# EAGLE design Ikaruga (EAGLE 7.7.0)
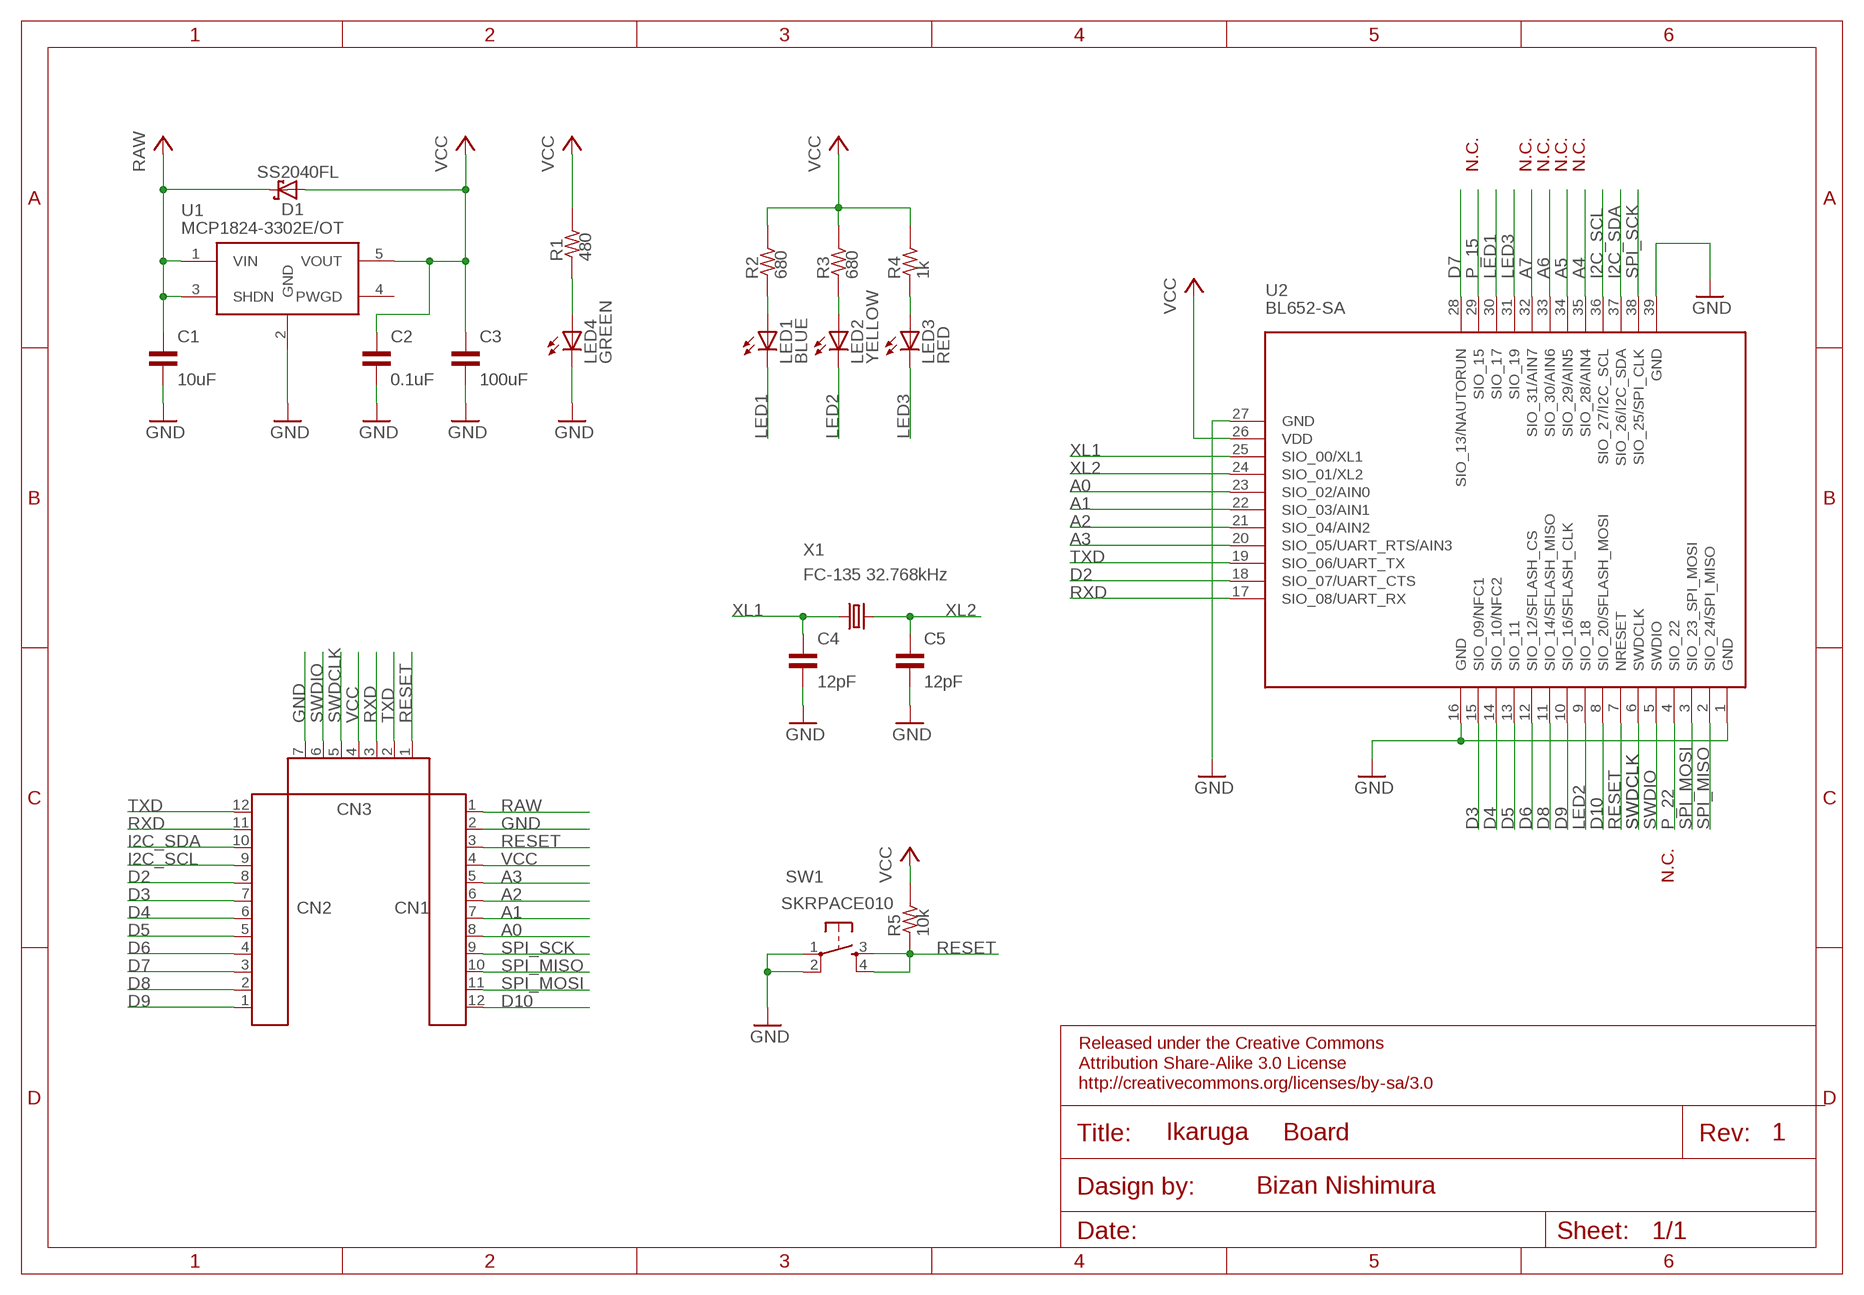
[diagram p0: schematic, sheet 1]

## Parts
C1  10uF  C-CP-3216  [CP3216]
C2  0.1uF  C-CP-1608  [CP1608]
C3  100uF  C-CP-3216  [CP3216]
C4  12pF  C-CP-1608  [CP1608]
C5  12pF  C-CP-1608  [CP1608]
CN1  PINHD-1X12-NO-LINE  [1X12-NO-LINE]
CN2  PINHD-1X12-NO-LINE  [1X12-NO-LINE]
CN3  PINHD-1X7-NO-LINE  [1X07-NO-LINE]
D1  SS2040FL  SCHOTTKY-DIODE-SOD123  [SOD123]
LED1  BLUE  LED1608  [LED1608]
LED2  YELLOW  LED1608  [LED1608]
LED3  RED  LED1608  [LED1608]
LED4  GREEN  LED1608  [LED1608]
R1  480  R-CP-1608  [CP1608]
R2  680  R-CP-1608  [CP1608]
R3  680  R-CP-1608  [CP1608]
R4  1k  R-CP-1608  [CP1608]
R5  10k  R-CP-1608  [CP1608]
SW1  SKRPACE010  [SKRPACE010]
U1  MCP1824-3302E/OT  [SOT-23-5]
U2  BL652-SA  [BL652-SA]
X1  FC-135 32.768kHz  FC-135  [FC-135]

## Nets
A0: CN1.8 U2.23(SIO_02/AIN0)
A1: CN1.7 U2.22(SIO_03/AIN1)
A2: CN1.6 U2.21(SIO_04/AIN2)
A3: CN1.5 U2.20(SIO_05/UART_RTS/AIN3)
A4: U2.35(SIO_28/AIN4)
A5: U2.34(SIO_29/AIN5)
A6: U2.33(SIO_30/AIN6)
A7: U2.32(SIO_31/AIN7)
D2: CN2.8 U2.18(SIO_07/UART_CTS)
D3: CN2.7 U2.15(SIO_09/NFC1)
D4: CN2.6 U2.14(SIO_10/NFC2)
D5: CN2.5 U2.13(SIO_11)
D6: CN2.4 U2.12(SIO_12/SFLASH_CS)
D7: CN2.3 U2.28(SIO_13/NAUTORUN)
D8: CN2.2 U2.11(SIO_14/SFLASH_MISO)
D9: CN2.1 U2.10(SIO_16/SFLASH_CLK)
D10: CN1.12 U2.8(SIO_20/SFLASH_MOSI)
GND: C1.SMD2(PIN2) C2.SMD2(PIN2) C3.SMD2(PIN2) C4.SMD2(PIN2) C5.SMD2(PIN2) CN1.2 CN3.7 LED4.C SW1.1 SW1.2 U1.2(GND) U2.1(GND) U2.16(GND) U2.27(GND) U2.39(GND)
I2C_SCL: CN2.9 U2.36(SIO_27/I2C_SCL)
I2C_SDA: CN2.10 U2.37(SIO_26/I2C_SDA)
LED1: LED1.C U2.30(SIO_17)
LED2: LED2.C U2.9(SIO_18)
LED3: LED3.C U2.31(SIO_19)
N$1: LED4.A R1.SMD1(PIN1)
N$2: LED1.A R2.SMD1(PIN1)
N$3: LED2.A R3.SMD1(PIN1)
N$13: LED3.A R4.SMD1(PIN1)
P_15: U2.29(SIO_15)
P_22: U2.4(SIO_22)
RAW: C1.SMD1(PIN1) CN1.1 D1.C U1.1(VIN) U1.3(SHDN)
RESET: CN1.3 CN3.1 R5.SMD1(PIN1) SW1.3 SW1.4 U2.7(NRESET)
RXD: CN2.11 CN3.3 U2.17(SIO_08/UART_RX)
SPI_MISO: CN1.10 U2.2(SIO_24/SPI_MISO)
SPI_MOSI: CN1.11 U2.3(SIO_23_SPI_MOSI)
SPI_SCK: CN1.9 U2.38(SIO_25/SPI_CLK)
SWDCLK: CN3.5 U2.6(SWDCLK)
SWDIO: CN3.6 U2.5(SWDIO)
TXD: CN2.12 CN3.2 U2.19(SIO_06/UART_TX)
VCC: C2.SMD1(PIN1) C3.SMD1(PIN1) CN1.4 CN3.4 D1.A R1.SMD2(PIN2) R2.SMD2(PIN2) R3.SMD2(PIN2) R4.SMD2(PIN2) R5.SMD2(PIN2) U1.5(VOUT) U2.26(VDD)
XL1: C4.SMD1(PIN1) U2.25(SIO_00/XL1) X1.1
XL2: C5.SMD1(PIN1) U2.24(SIO_01/XL2) X1.2
Unconnected: U1.4(PWGD)

## Notes on the sheet
- N.C. | N.C. | N.C. | N.C. | N.C.
- N.C.
- Board | 1
- Bizan Nishimura

## Library data of the parts
C1-C5 = lipoyang_cr:C-: CAPACITOR Japanese symbol
CN1 CN2 = lipoyang_mechanical:PINHD-1X12: PIN HEADER
CN3 = lipoyang_mechanical:PINHD-1X7: PIN HEADER
D1 = lipoyang_discrete:SCHOTTKY-DIODE: Schottky Diode
LED1-LED4 = lipoyang_discrete:LED: LED
R1-R5 = lipoyang_cr:R-: RESISTOR Japanese symbol
SW1 = lipoyang_mechanical:SKRPACE010
U1 = lipoyang_ic:MCP1824-3302E/OT
U2 = lipoyang_rf:BL652: BL652 Laird nRF52 module
X1 = lipoyang_discrete:FC-135: kHz RANGE CRYSTAL UNIT LOW PROFILE SMD

## Board
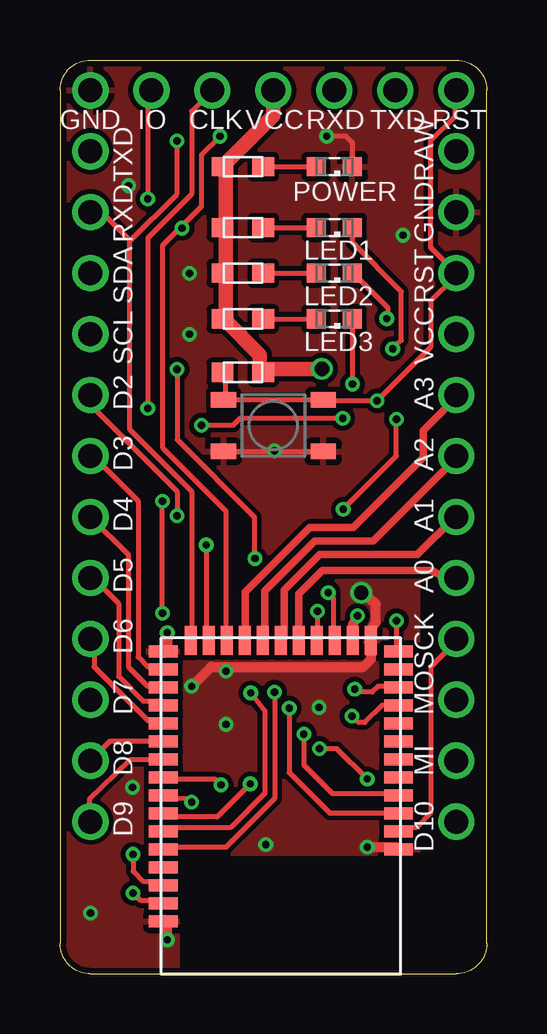
[diagram p1: board, top side]
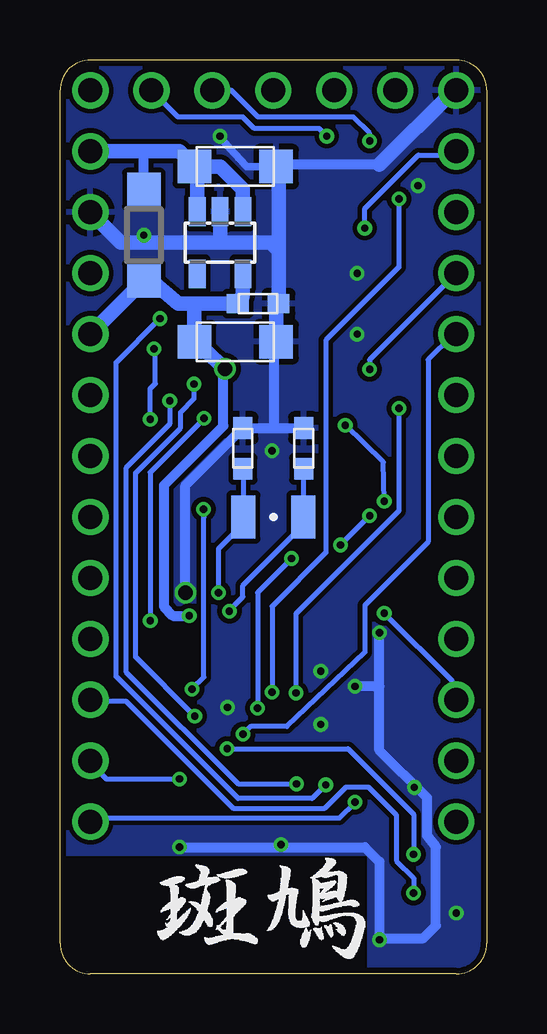
[diagram p2: board, bottom side, seen from below]

Size 17.78 x 38.1 mm. Coordinates in mm from the lower left corner, seen from the top.
Outline: 17.78,1.27 17.78,36.83 arc90 16.51,38.1 1.27,38.1 arc90 0,36.83 0,1.27 arc90 1.27,0 16.51,0 arc90 17.78,1.27
Copper layers (1*16): Top 0.035mm / dielectric 1.5mm / Bottom 0.035mm
Design rules "SeeedStudio_2layer_DRU_no_angle_20140221_lipoyang": minimum track width 8mil, minimum drill 12mil, track to track 8mil, track to pad 8mil, pad to pad 8mil, via to via 8mil, smd to smd 0mil, copper to edge 10mil, drill to drill 10mil, minimum pad ring 10mil, minimum via ring 6mil, stop-mask expansion 2mil, vias tented up to drill 100mil, thermal gap 10mil

### Footprints (pad centres in the part's own frame; a part is rotated, then mirrored left to right if it is on the bottom)
CP3216 = smd 1.4 x 1.4: SMD1 -1.7,0; SMD2 1.7,0
CP1608 = smd 0.9 x 0.8: SMD1 -0.85,0; SMD2 0.85,0
1X12-NO-LINE = drill 1: 1 -13.97,0; 2 -11.43,0; 3 -8.89,0; 4 -6.35,0; 5 -3.81,0; 6 -1.27,0; 7 1.27,0; 8 3.81,0; 9 6.35,0; 10 8.89,0; 11 11.43,0; 12 13.97,0
1X07-NO-LINE = drill 1: 1 -7.62,0; 2 -5.08,0; 3 -2.54,0; 4 0,0; 5 2.54,0; 6 5.08,0; 7 7.62,0
SOD123 = smd 1.4 x 1.4: A 1.9,0; C -1.9,0
LED1608 = smd 0.8 x 0.8: A 0.75,0; C -0.75,0
SKRPACE010 = smd 1.05 x 0.65: 1 -2.075,1.075; 2 2.075,1.075; 3 -2.075,-1.075; 4 2.075,-1.075
SOT-23-5 = smd 0.69 x 1.2: 1 -0.95,-1.3; 2 0,-1.3; 3 0.95,-1.3; 4 0.95,1.3; 5 -0.95,1.3
BL652-SA = smd 1.2 x 0.5: 1 4.9,4.8; 2 4.9,4.05; 3 4.9,3.3; 4 4.9,2.55; 5 4.9,1.8; 6 4.9,1.05; 7 4.9,0.3; 8 4.9,-0.45; 9 4.9,-1.2; 10 4.9,-1.95; 11 4.9,-2.7; 12 4.9,-3.45; 13 4.9,-4.2; 14 4.9,-4.95; 15 4.9,-5.7; 16 4.9,-6.45; 28 -4.9,-6.45; 29 -4.9,-5.7; 30 -4.9,-4.95; 31 -4.9,-4.2; 32 -4.9,-3.45; 33 -4.9,-2.7; 34 -4.9,-1.95; 35 -4.9,-1.2; 36 -4.9,-0.45; 37 -4.9,0.3; 38 -4.9,1.05; 39 -4.9,1.8 | smd 0.5 x 1.2: 17 3.75,-6.9; 18 3,-6.9; 19 2.25,-6.9; 20 1.5,-6.9; 21 0.75,-6.9; 22 0,-6.9; 23 -0.75,-6.9; 24 -1.5,-6.9; 25 -2.25,-6.9; 26 -3,-6.9; 27 -3.75,-6.9
FC-135 = smd 1 x 1.8: 1 -1.25,0; 2 1.25,0

### Placement (x,y rotation side)
C1  10.48,33.66 0 bottom
C2  9.53,27.94 0 bottom
C3  10.48,26.35 0 bottom
C4  10.16,21.91 90 bottom
C5  7.62,21.91 90 bottom
CN1  16.51,20.32 270 top
CN2  1.27,20.32 90 top
CN3  8.89,36.83 180 top
D1  14.29,30.8 270 bottom
LED1  11.43,31.11 180 top
LED2  11.43,29.21 180 top
LED3  11.43,27.3 180 top
LED4  11.43,33.66 180 top
R1  7.62,33.66 180 top
R2  7.62,31.11 180 top
R3  7.62,29.21 180 top
R4  7.62,27.3 180 top
R5  7.62,25.08 0 top
SW1  8.89,22.86 180 top
U1  11.11,30.48 180 bottom
U2  9.21,7 180 top
U$1  [IKARUGA_B]  5.08,0.64 0 top
X1  8.89,19.05 0 bottom

### Tracks (layer width: path | path; a pad name or v marks a point on that pad's centre or on a via)
A0
  Top 0.203: 9.96,14.02 U2.23
  Top 0.305: 9.96,14.02 9.96,15.85 10.93,16.82 15.51,16.82 16.03,16.51 CN1.8
A1
  Top 0.203: 9.35,14.02 U2.22 | 16.46,19.06 CN1.7
  Top 0.305: 9.35,14.02 9.35,16.01 10.81,17.48 14.88,17.48 16.46,19.06
A2
  Top 0.203: 16.62,21.61 16.46,21.54 CN1.6 | 8.53,14.02 U2.21
  Top 0.305: 8.53,14.02 8.53,15.96 10.61,18.04 13.05,18.04 16.62,21.61
A3
  Top 0.203: 7.72,14.02 U2.20 | 16.46,23.98 CN1.5
  Top 0.305: 7.72,14.02 7.72,15.92 10.41,18.61 12.21,18.61 15.13,21.52 15.13,22.64 16.46,23.98
D2  (via drill 0.3)
  Top 0.203: v6.1,17.88 6.1,14.02 U2.18 | v4.88,19.1 4.88,20.12 1.42,23.57 1.42,23.98 CN2.8
  Bottom 0.203: v4.88,19.1 v6.1,17.88
D3
  Top 0.203: U2.15 4.27,12.8 3.66,12.8 3.25,13.21 3.25,19.71 1.42,21.54 CN2.7
D4
  Top 0.203: CN2.6 2.85,17.48 2.85,12.8 3.66,11.99 4.27,11.99 U2.14
D5
  Top 0.203: U2.13 4.27,11.38 3.45,11.38 2.44,12.39 2.44,15.44 1.42,16.46 CN2.5
D6
  Top 0.203: U2.12 4.27,10.57 3.66,10.57 1.42,12.8 1.42,13.82 CN2.4
D7  (via drill 0.3)
  Top 0.203: v14.02,14.72 14.02,13.61 U2.28 | v11.78,23.16 7.52,23.16 7.23,22.87 v5.89,22.87 | v4.27,15.04 v4.27,19.71
  Bottom 0.203: v14.02,14.72 14.02,20.9 11.78,23.15 v11.78,23.16 | v5.89,22.87 4.3,21.34 v4.27,19.71 | v4.27,15.04 1.42,12.19 1.42,11.58 CN2.3
D8
  Top 0.203: U2.11 2.08,9.7 CN2.2
D9
  Top 0.203: U2.10 4.27,8.94 2.91,8.94 2.86,8.89 1.22,7.3 CN2.1
D10  (via drill 0.3)
  Top 0.203: v5.49,7.16 5.38,7.16 5.24,7.3 4.47,7.32 U2.8
  Bottom 0.203: v5.49,7.16 6.14,6.5 16.46,6.5 CN1.12
GND  (via drill 0.3, 0.6)
  Top 0.203: SW1.2 8.94,21.79 | 8.94,21.79 SW1.1 | 4.47,2.03 U2.1 | 14.02,5.28 U2.39 | 4.47,13.61 U2.16 | v8.94,21.81 8.94,21.79 | 8.94,21.74 8.94,21.79 | 12.19,33.53 LED4.C | 12.19,33.85 12.19,34.64 11.91,34.92 v11.11,34.92
  Top 0.254: 12.19,33.53 12.19,33.85
  Top 0.406: v4.47,1.42 4.47,2.03 | 14.02,5.28 v12.8,5.28 | v4.47,14.22 4.47,13.61 | v5.49,11.99 6.3,12.8 12.64,12.8 12.96,13.12 U2.27 12.96,14.39 13.02,14.45 13.16,14.66 13.16,15.42 v12.55,15.89
  Bottom 0.203: 7.72,22.76 C5.SMD2 | C4.SMD2 | 8.87,26.05 C3.SMD2 9.35,26.42 | 8.87,33.73 C1.SMD2 | 1.42,36.78 CN3.7 | 10.16,22.55 C4.SMD2 | 8.57,27.94 C2.SMD2
  Bottom 0.305: v11.11,34.92 11.16,34.92 10.05,33.7 10,33.66 C1.SMD2
  Bottom 0.406: 4.47,1.49 4.47,4.67 5.08,5.28 v12.8,5.28 | 4.47,1.49 v4.47,1.42 | 4.47,11.99 4.47,9.33 2.5,7.35 2.5,5.77 2.12,5.3 2.12,2.01 2.64,1.49 4.47,1.49 | 4.47,11.99 v4.47,14.22 | 4.47,11.99 v5.49,11.99 | 8.87,22.76 C4.SMD2 12.55,20.36 v12.55,15.89 | 8.87,22.76 7.72,22.76 | 8.87,26.05 8.87,22.76 | 4.47,33.73 8.87,33.73
  Bottom 0.61: 1.42,36.78 4.47,33.73 | CN1.2 15.24,30.48 11.11,30.48 | C2.SMD2 8.68,30.16 | 8.68,30.16 8.68,33.55 C1.SMD2 | U1.2 11.11,30.48 | 11.11,30.48 8.99,30.48 8.68,30.16 | C3.SMD2 8.78,27.73 8.57,27.94
  other vias: 5.4,29.21 5.4,26.67 10.79,11.11 2.86,32.86 1.27,2.54 3.02,7.78 8.57,5.4 6.92,10.4 6.92,12.62 14.29,30.8
  pour Top: -1.27,-0.64 5.08,-0.64 5.08,4.76 14.92,4.76 14.92,16.51 19.05,16.51 19.05,38.73 -1.27,38.73 -1.27,26.04 5.08,19.68 5.08,13.97 -1.27,13.97
  pour Bottom: -0.64,38.73 -0.64,-0.64 5.08,-0.64 5.08,5 18.41,5 18.41,38.73
I2C_SCL  (via drill 0.3)
  Top 0.203: v10.16,10 10.16,8.71 11.35,7.52 14.02,7.52 U2.36
  Bottom 0.203: v10.16,10 9.84,10.32 8.33,10.32 5.08,13.41 5.08,15.37 2.44,18.01 2.44,25.6 1.42,26.62 CN2.9
I2C_SDA  (via drill 0.3)
  Top 0.203: v9.55,11.08 9.55,8.39 11.24,6.71 14.02,6.71 U2.37 | v4.88,25.21 4.88,22.27 8.1,19.05 8.1,17.35 v8.13,17.32
  Bottom 0.203: v9.55,11.08 9.55,15.89 v8.13,17.32 | v4.88,25.21 4.88,25.6 CN2.10
LED1  (via drill 0.3)
  Top 0.203: v13.86,26.05 14.22,26.42 14.22,28.45 12.19,30.48 12.19,31.09 LED1.C | v14.02,23.12 14.02,21.59 v11.8,19.37 | U2.30 14.02,11.99 13.26,11.99 13.02,11.75 12.41,11.75 v12.28,11.87
  Bottom 0.203: v12.28,11.87 11.79,12.37 11.79,19.04 v11.8,19.37 | v14.02,23.12 14.02,24.4 13.81,24.61 13.81,26 v13.86,26.05
LED2  (via drill 0.3)
  Top 0.203: LED2.C 12.19,29.06 12.38,29.06 13.65,27.78 13.65,27.36 v13.61,27.32 | U2.9 4.47,8.13 6.46,8.13 v6.71,7.88
  Bottom 0.203: v13.61,27.32 15.44,25.49 15.44,12.39 10.36,7.32 7.27,7.32 v6.71,7.88
LED3  (via drill 0.3)
  Top 0.203: v12.19,24.59 12.19,27.23 LED3.C | U2.31 13.42,11.2 12.7,10.48 12.43,10.48 v12.17,10.74
  Bottom 0.203: v12.19,24.59 12.19,23.98 12.76,23.41 12.76,22.76 14.63,20.89 14.63,13.21 v12.17,10.74
N$1
  Top 0.203: R1.SMD1 LED4.A
N$2
  Top 0.203: R2.SMD1 LED1.A
N$3
  Top 0.203: R3.SMD1 LED2.A
N$13
  Top 0.203: R4.SMD1 LED3.A
RAW
  Bottom 0.406: D1.C 14.29,34.29
  Bottom 0.61: CN1.1 14.29,34.29 12.81,34.29 C1.SMD1 | 12.38,33.45 C1.SMD1 | U1.3 12.06,33.54 C1.SMD1 | U1.1 10.16,32.7 11.11,33.66 C1.SMD1
RESET  (via drill 0.3)
  Top 0.203: SW1.3 SW1.4 6.91,23.98 6.91,24.99 R5.SMD1 | 10.97,23.98 SW1.3 | v7.92,7.92 6.55,6.55 4.46,6.55 U2.7 4.47,6.71 | CN3.1 16.46,36.78 16.46,35.76 15.44,34.75 15.44,30.28 CN1.3 16.46,29.06 15.44,28.04 15.44,26.12 v13.21,23.89 11.01,23.89 SW1.3
  Bottom 0.203: v7.92,7.92 10.36,7.92 15.04,12.6 15.04,21.09 13.21,22.92 v13.21,23.89
RXD  (via drill 0.3)
  Top 0.203: U2.17 5.49,14.02 5.49,20.12 2.92,22.69 2.92,30.55 | v4.88,34.72 4.88,32.51 2.92,30.55 | 2.92,30.55 2.92,30.58 1.91,31.59 1.43,31.59 CN2.11
  Bottom 0.203: CN3.3 10.64,36.83 9.53,35.72 5.56,35.72 4.88,35.04 v4.88,34.72
SPI_MISO  (via drill 0.3)
  Top 0.203: U2.2 4.27,3.05 3.37,3.05 v3.05,3.37
  Bottom 0.203: v3.05,3.37 3.05,4 3.77,4.72 3.77,6.62 4.92,7.78 5.87,7.78 6.74,6.91 10.57,6.91 15.04,11.38 16.46,11.38 CN1.10
SPI_MOSI  (via drill 0.3)
  Top 0.203: v3.05,4.99 3.05,4.27 3.45,3.86 4.27,3.86 U2.3 | v10.81,9.39 11.54,9.39 v12.8,8.13
  Bottom 0.203: v3.05,4.99 3.05,6.66 5.78,9.39 v10.81,9.39 | v12.8,8.13 15.85,8.13 16.46,8.74 CN1.11
SPI_SCK
  Top 0.203: U2.38 14.22,6.1 14.83,6.1 15.44,6.71 15.44,12.8 16.46,13.82 CN1.9
SWDCLK  (via drill 0.3)
  Top 0.203: v7.95,11.72 8.53,10.97 8.53,7.52 7.11,6.1 4.47,6.1 U2.6 | v3.66,23.58 3.66,30.68 5.49,32.51 5.49,35.97 CN3.5
  Bottom 0.203: v7.95,11.72 7.95,15.01 3.66,19.3 v3.66,23.58
SWDIO  (via drill 0.3)
  Top 0.203: v8.94,11.74 8.94,7.32 6.91,5.28 4.47,5.28 U2.5 | v3.66,32.31 3.66,36.78 CN3.6
  Bottom 0.203: v8.94,11.74 8.94,15.33 6.71,17.56 6.71,26.42 3.66,29.46 v3.66,32.31
TXD  (via drill 0.3)
  Top 0.203: 5.04,31.13 5.89,31.99 5.89,34.15 v6.67,34.92 | 5.04,31.13 4.27,30.37 4.27,21.95 6.91,19.3 6.91,14.02 U2.19 | 5.04,31.13 v5.08,31.09
  Bottom 0.203: v5.08,31.09 5.08,31.9 2.85,34.14 1.42,34.14 CN2.12 | v6.67,34.92 6.99,35.24 9.68,35.24 10.16,35.72 12.86,35.72 CN3.2
VCC  (via drill 0.3, 0.6)
  Top 0.203: 8.33,25.2 R5.SMD2 8.53,24.99 | 6.91,27.23 R4.SMD2 6.91,27.43 | 6.91,29.06 R3.SMD2 6.91,29.26 | 6.91,31.09 R2.SMD2 6.91,31.29 | 6.91,33.53 R1.SMD2
  Top 0.406: U2.26 12.21,14.53 v12.39,14.93
  Top 0.61: 8.33,25.2 8.33,25.81 6.91,27.23 | 6.91,27.43 6.91,29.06 | 6.91,29.26 6.91,31.09 | 6.91,31.29 6.91,33.53 | CN3.4 8.89,35.77 R1.SMD2 | v10.91,25.22 8.65,25.22 R5.SMD2
  Bottom 0.406: v12.39,14.93 13.08,14.93 13.46,15.33 13.46,20.36 10.97,22.85 10.97,25.16
  Bottom 0.61: CN1.4 D1.A 13.97,28.9 12.86,27.94 12.38,27.94 | U1.5 10.16,28.26 10.38,28.04 C2.SMD1 12.38,27.94 | 12.38,27.94 12.18,27.73 C3.SMD1 12.18,26.17 11.88,26.17 11.75,26.04 v10.91,25.22 10.97,25.16
XL1  (via drill 0.3)
  Top 0.203: v11.18,15.89 11.38,15.69 11.38,14.02 U2.25
  Bottom 0.203: C4.SMD1 10.14,21.06 X1.1 10.16,18.9 10.16,18.73 10.48,18.41 11.18,17.72 v11.18,15.89
XL2  (via drill 0.3)
  Top 0.203: v10.72,15.13 10.72,13.92 U2.24
  Bottom 0.203: X1.2 7.62,19.05 C5.SMD1 | 7.72,18.9 X1.2 | v10.72,15.13 10.72,15.15 10.16,15.72 10.16,16.19 7.94,18.41 7.94,18.75 X1.2

### Text on the board
tPlace: GND | IO | CLK | VCC | RXD | TXD | RST | TXD | RAW | POWER | RXD | GND | SDA | RST | SCL | VCC | D2 | A3 | D3 | A2 | D4 | A1 | D5 | A0 | D6 | SCK | D7 | MO | D8 | MI | D9 | D10